# EAGLE design controllerv2 (EAGLE 6.1)
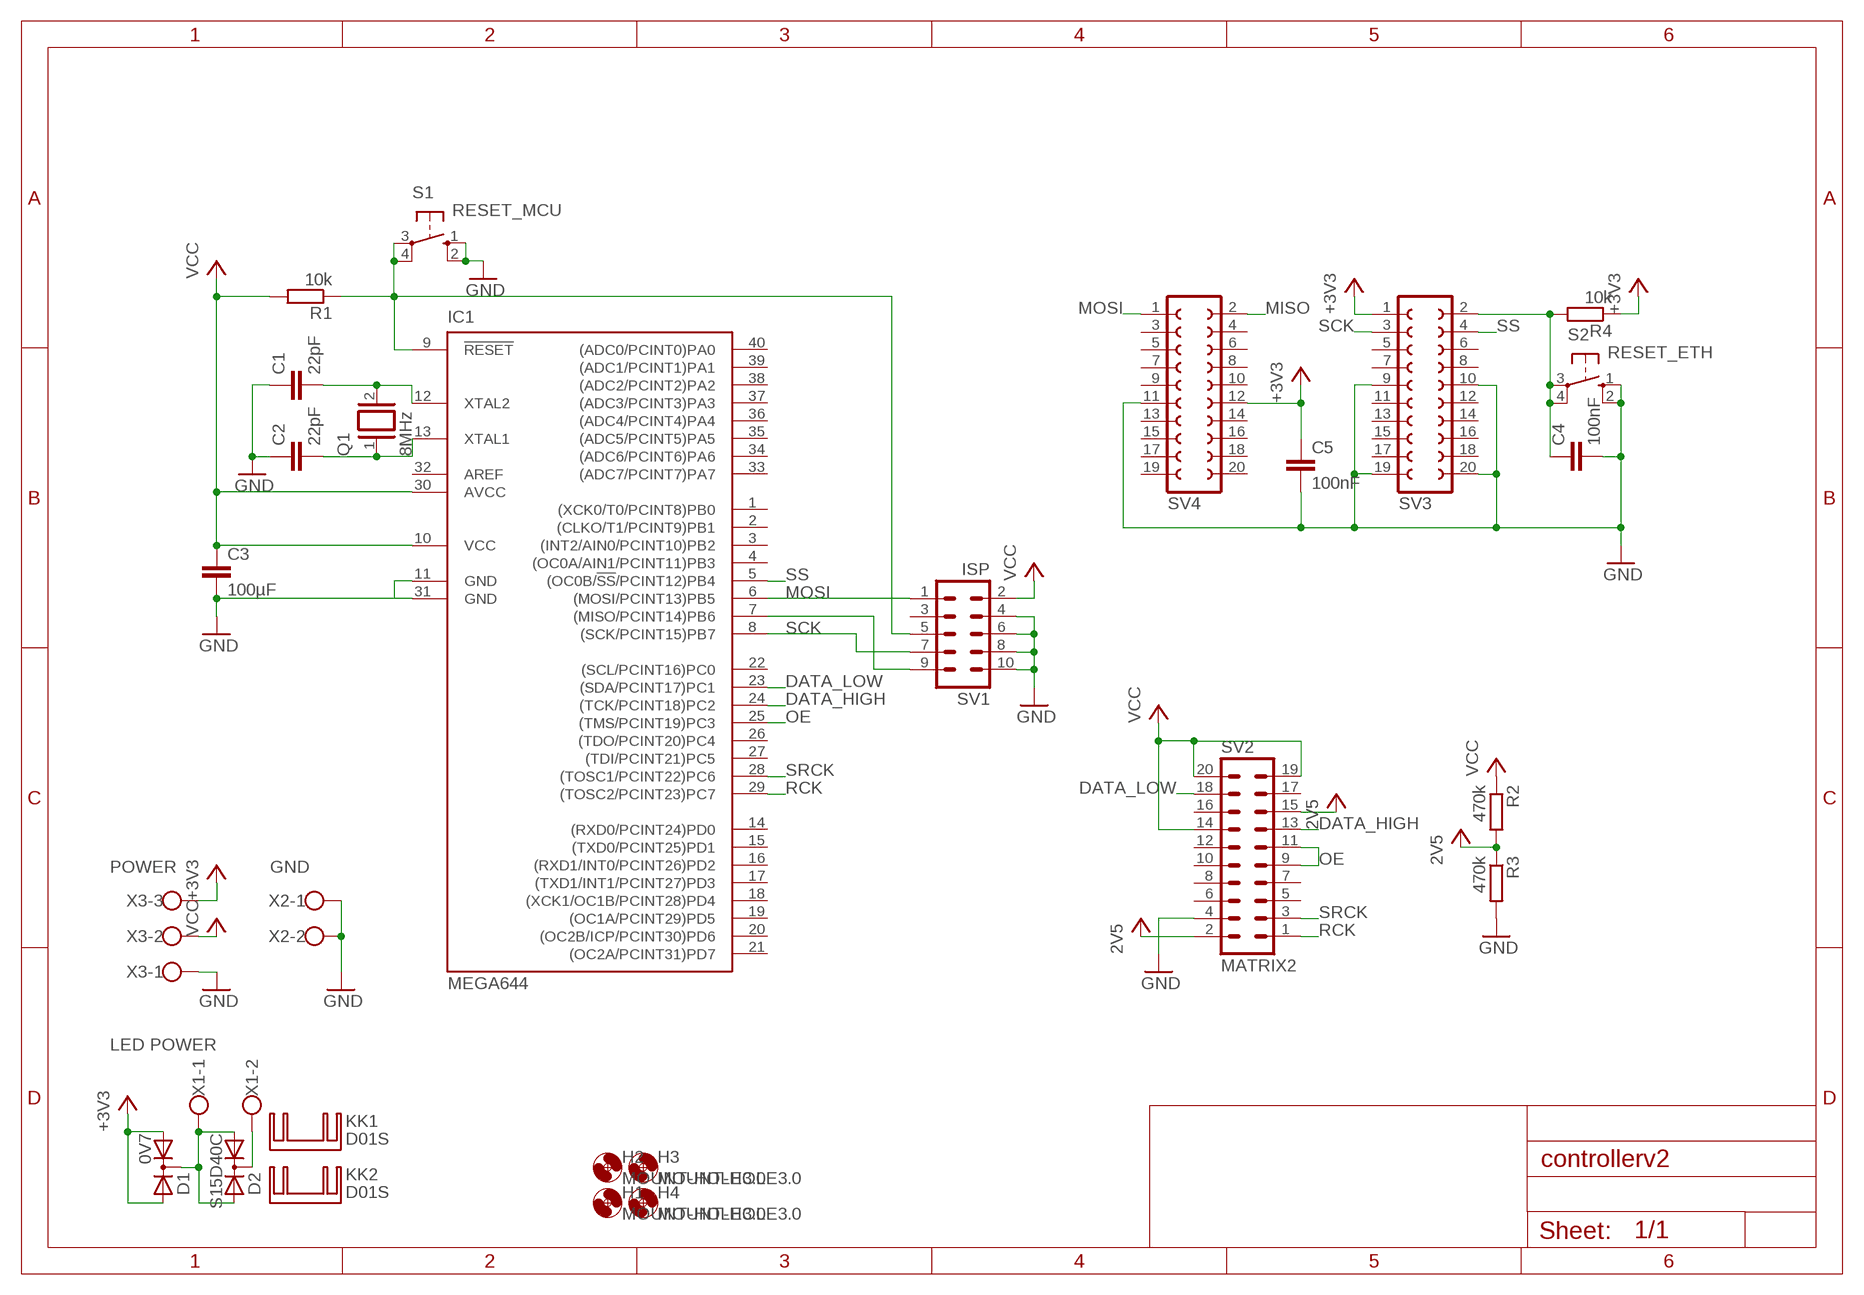
[diagram p0: schematic, sheet 1]

## Parts
C1  22pF  C-EU050-024X044  [C050-024X044]
C2  22pF  C-EU050-024X044  [C050-024X044]
C3  100µF  C-EU050-030X075  [C050-030X075]
C4  100nF  C-EU050-024X044  [C050-024X044]
C5  100nF  C-EU050-024X044  [C050-024X044]
D1  0V7  S15D40C  [TO247BV]
D2  S15D40C  [TO247BV]
H1  MOUNT-HOLE3.0  [3,0]
H2  MOUNT-HOLE3.0  [3,0]
H3  MOUNT-HOLE3.0  [3,0]
H4  MOUNT-HOLE3.0  [3,0]
IC1  MEGA644  MEGA164P/324P/644P-PU  [DIL40]
KK1  D01S  [D01S]
KK2  D01S  [D01S]
Q1  8MHz  XTAL/S  [QS]
R1  10k  R-EU_0207/10  [0207/10]
R2  470k  R-EU_0207/10  [0207/10]
R3  470k  R-EU_0207/10  [0207/10]
R4  10k  R-EU_0207/10  [0207/10]
S1  RESET_MCU  10-XX  [B3F-10XX]
S2  RESET_ETH  10-XX  [B3F-10XX]
SV1  ISP  ML10  [ML10]
SV2  MATRIX2  ML20  [ML20]
SV3  FE10-2  [FE10-2]
SV4  FE10-2  [FE10-2]
X1  LED POWER  W237-102  [W237-102]
X2  GND  W237-102  [W237-102]
X3  POWER  W237-103  [W237-103]

## Nets
+3V3: C5.1 D1.G(A1) D1.S(A2) R2.2 R3.1 R4.1 SV2.2 SV2.15 SV3.1 SV4.12 X3.3 ; supply symbol labelled 2V5
DATA_HIGH: IC1.24((TCK/PCINT18)PC2) SV2.13
DATA_LOW: IC1.23((SDA/PCINT17)PC1) SV2.18
GND: C1.1 C2.1 C3.2 C4.2 C5.2 IC1.11(GND) IC1.31(GND) R3.2 S1.1(S) S1.2(S1) S2.1(S) S2.2(S1) SV1.4 SV1.6 SV1.8 SV1.10 SV2.4 SV3.9 SV3.10 SV3.19 SV3.20 SV4.11 X2.1 X2.2 X3.1
MISO: SV4.2
MOSI: IC1.6((MOSI/PCINT13)PB5) SV1.1 SV4.1
N$1: C4.1 R4.2 S2.3(P) S2.4(P1) SV3.2
N$2: C2.2 IC1.13(XTAL1) Q1.1
N$3: C1.2 IC1.12(XTAL2) Q1.2
N$4: IC1.9(!RESET) R1.1 S1.3(P) S1.4(P1) SV1.5
N$6: IC1.7((MISO/PCINT14)PB6) SV1.9
N$7: D1.D(C) D2.G(A1) D2.S(A2) X1.1
N$8: D2.D(C) X1.2
OE: IC1.25((TMS/PCINT19)PC3) SV2.9 SV2.11
RCK: IC1.29((TOSC2/PCINT23)PC7) SV2.1
SCK: IC1.8((SCK/PCINT15)PB7) SV1.7 SV3.3
SRCK: IC1.28((TOSC1/PCINT22)PC6) SV2.3
SS: IC1.5((OC0B/!SS!/PCINT12)PB4) SV3.4
VCC: C3.1 IC1.10(VCC) IC1.30(AVCC) R1.2 R2.1 SV1.2 SV2.14 SV2.19 SV2.20 X3.2
Unconnected: IC1.1((XCK0/T0/PCINT8)PB0) IC1.2((CLKO/T1/PCINT9)PB1) IC1.3((INT2/AIN0/PCINT10)PB2) IC1.4((OC0A/AIN1/PCINT11)PB3) IC1.14((RXD0/PCINT24)PD0) IC1.15((TXD0/PCINT25)PD1) IC1.16((RXD1/INT0/PCINT26)PD2) IC1.17((TXD1/INT1/PCINT27)PD3) IC1.18((XCK1/OC1B/PCINT28)PD4) IC1.19((OC1A/PCINT29)PD5) IC1.20((OC2B/ICP/PCINT30)PD6) IC1.21((OC2A/PCINT31)PD7) IC1.22((SCL/PCINT16)PC0) IC1.26((TDO/PCINT20)PC4) IC1.27((TDI/PCINT21)PC5) IC1.33((ADC7/PCINT7)PA7) IC1.34((ADC6/PCINT6)PA6) IC1.35((ADC5/PCINT5)PA5) IC1.36((ADC4/PCINT4)PA4) IC1.37((ADC3/PCINT3)PA3) IC1.38((ADC2/PCINT2)PA2) IC1.39((ADC1/PCINT1)PA1) IC1.40((ADC0/PCINT0)PA0) SV1.3 SV2.5 SV2.6 SV2.7 SV2.8 SV2.10 SV2.12 SV2.16 SV2.17 SV3.5 SV3.6 SV3.7 SV3.8 SV3.11 SV3.12 SV3.13 SV3.14 SV3.15 SV3.16 SV3.17 SV3.18 SV4.3 SV4.4 SV4.5 SV4.6 SV4.7 SV4.8 SV4.9 SV4.10 SV4.13 SV4.14 SV4.15 SV4.16 SV4.17 SV4.18 SV4.19 SV4.20

## Power pins joined to a net without a drawn wire
AREF: IC1.32(AREF)

## Library data of the parts
C1-C5 = resistor:C-EU: CAPACITOR, European symbol
D1 D2 = parts:S15D40C
H1-H4 = holes:MOUNT-HOLE: MOUNTING HOLE with drill center marker
IC1 = avr-5:MEGA164P/324P/644P-PU
KK1 KK2 = heatsink:D01S: HEATSINK distributor Schukat
Q1 = special:XTAL/S: CRYSTAL
R1-R4 = resistor:R-EU_: RESISTOR, European symbol
S1 S2 = switch-omron:10-XX: OMRON SWITCH; MPN: B3F-1000; OC_FARNELL: 176432; OC_NEWARK: 36M3542
SV1 = con-ml:ML10: HARTING; OC_FARNELL: unknown; OC_NEWARK: unknown
SV2 = con-ml:ML20: HARTING; OC_FARNELL: unknown; OC_NEWARK: unknown
SV3 SV4 = con-lsta:FE10-2: FEMALE HEADER; OC_FARNELL: unknown; OC_NEWARK: unknown
X1 X2 = con-wago-500:W237-102: WAGO SCREW CLAMP; MPN: 237-102; OC_FARNELL: unknown; OC_NEWARK: 70K9898
X3 = con-wago-500:W237-103: WAGO SCREW CLAMP; MPN: 237-103; OC_FARNELL: unknown; OC_NEWARK: 18M7116

## Board
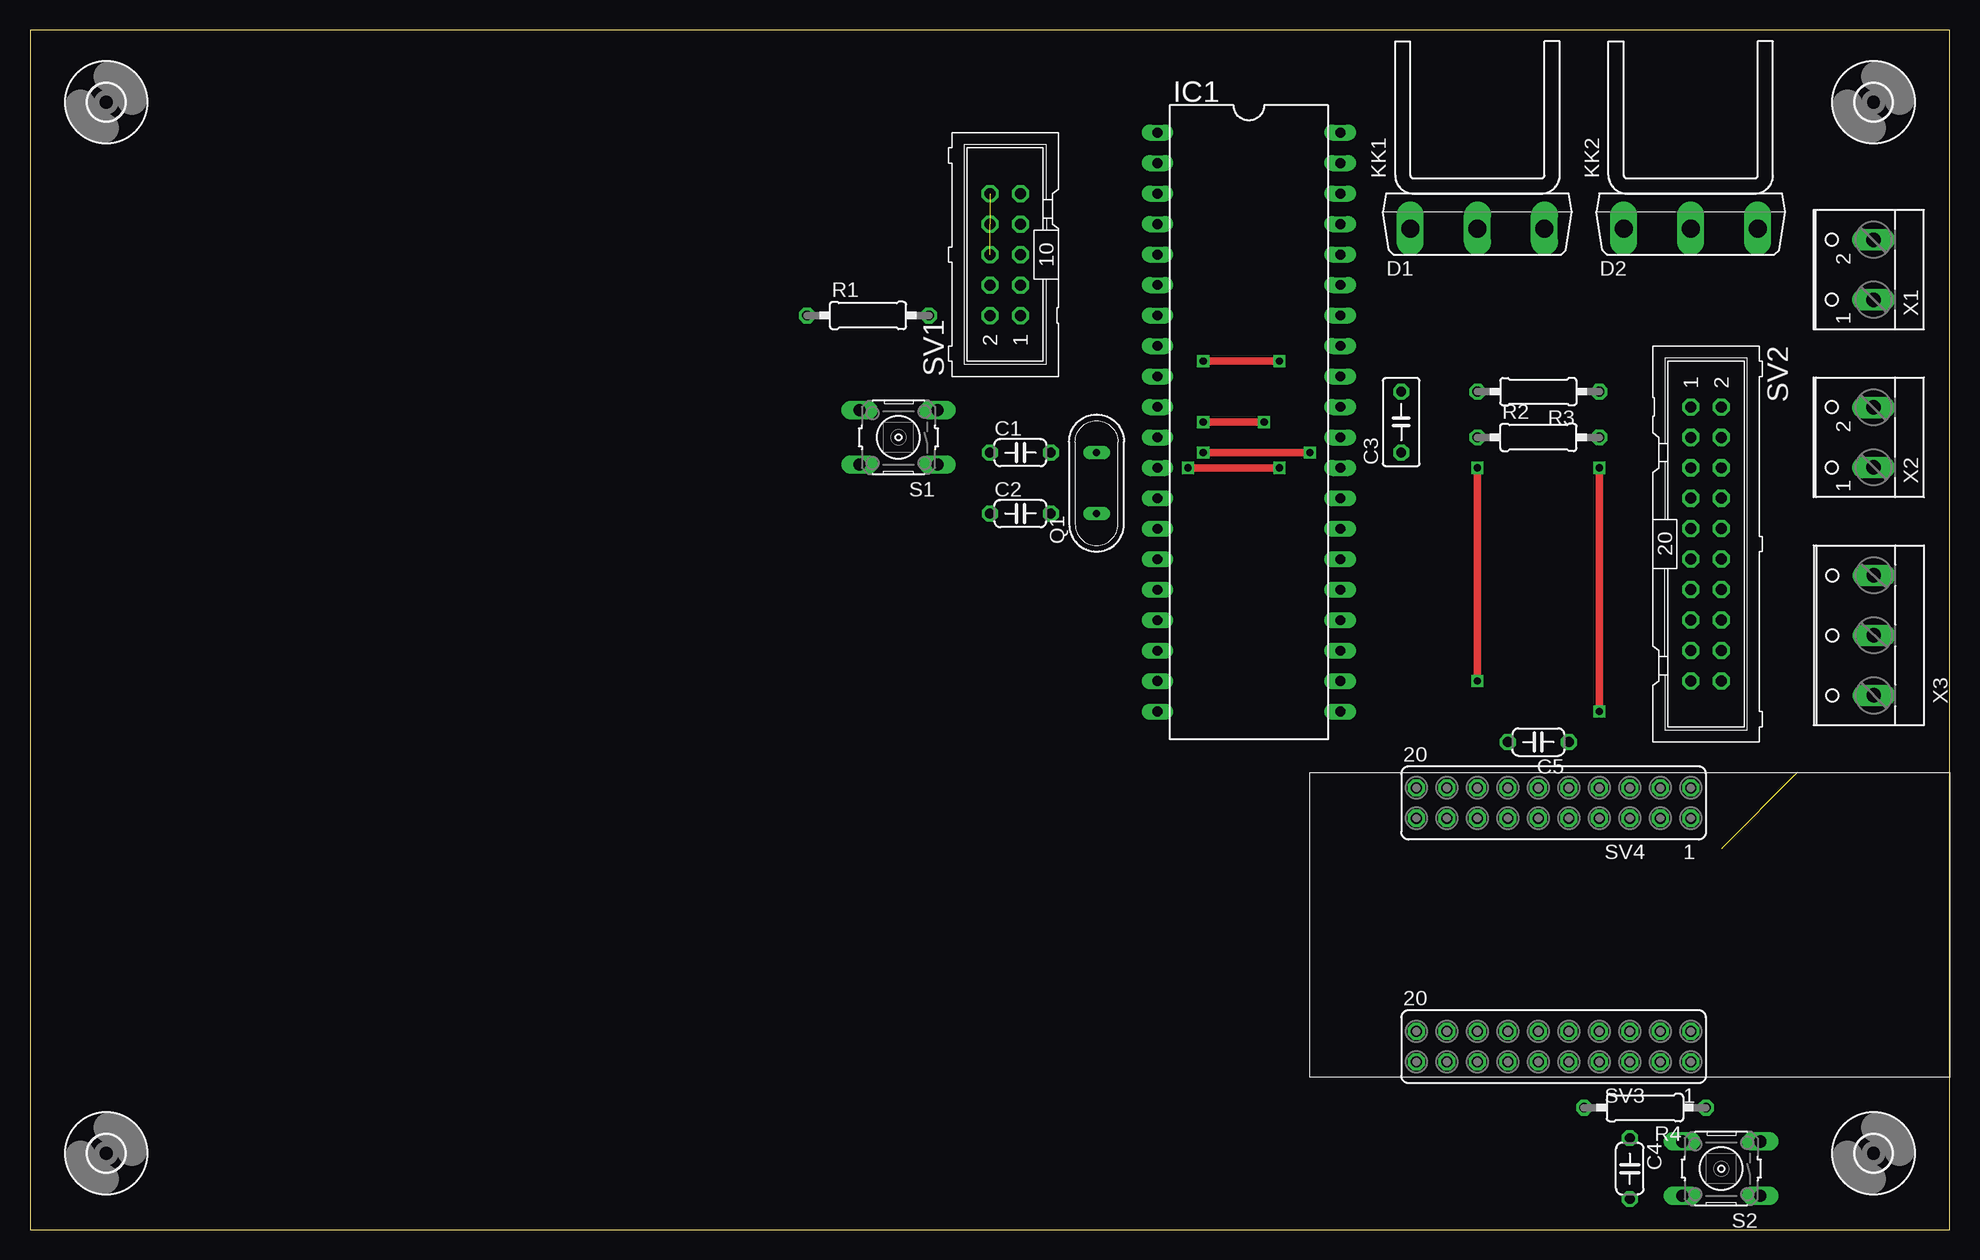
[diagram p1: board, top side]
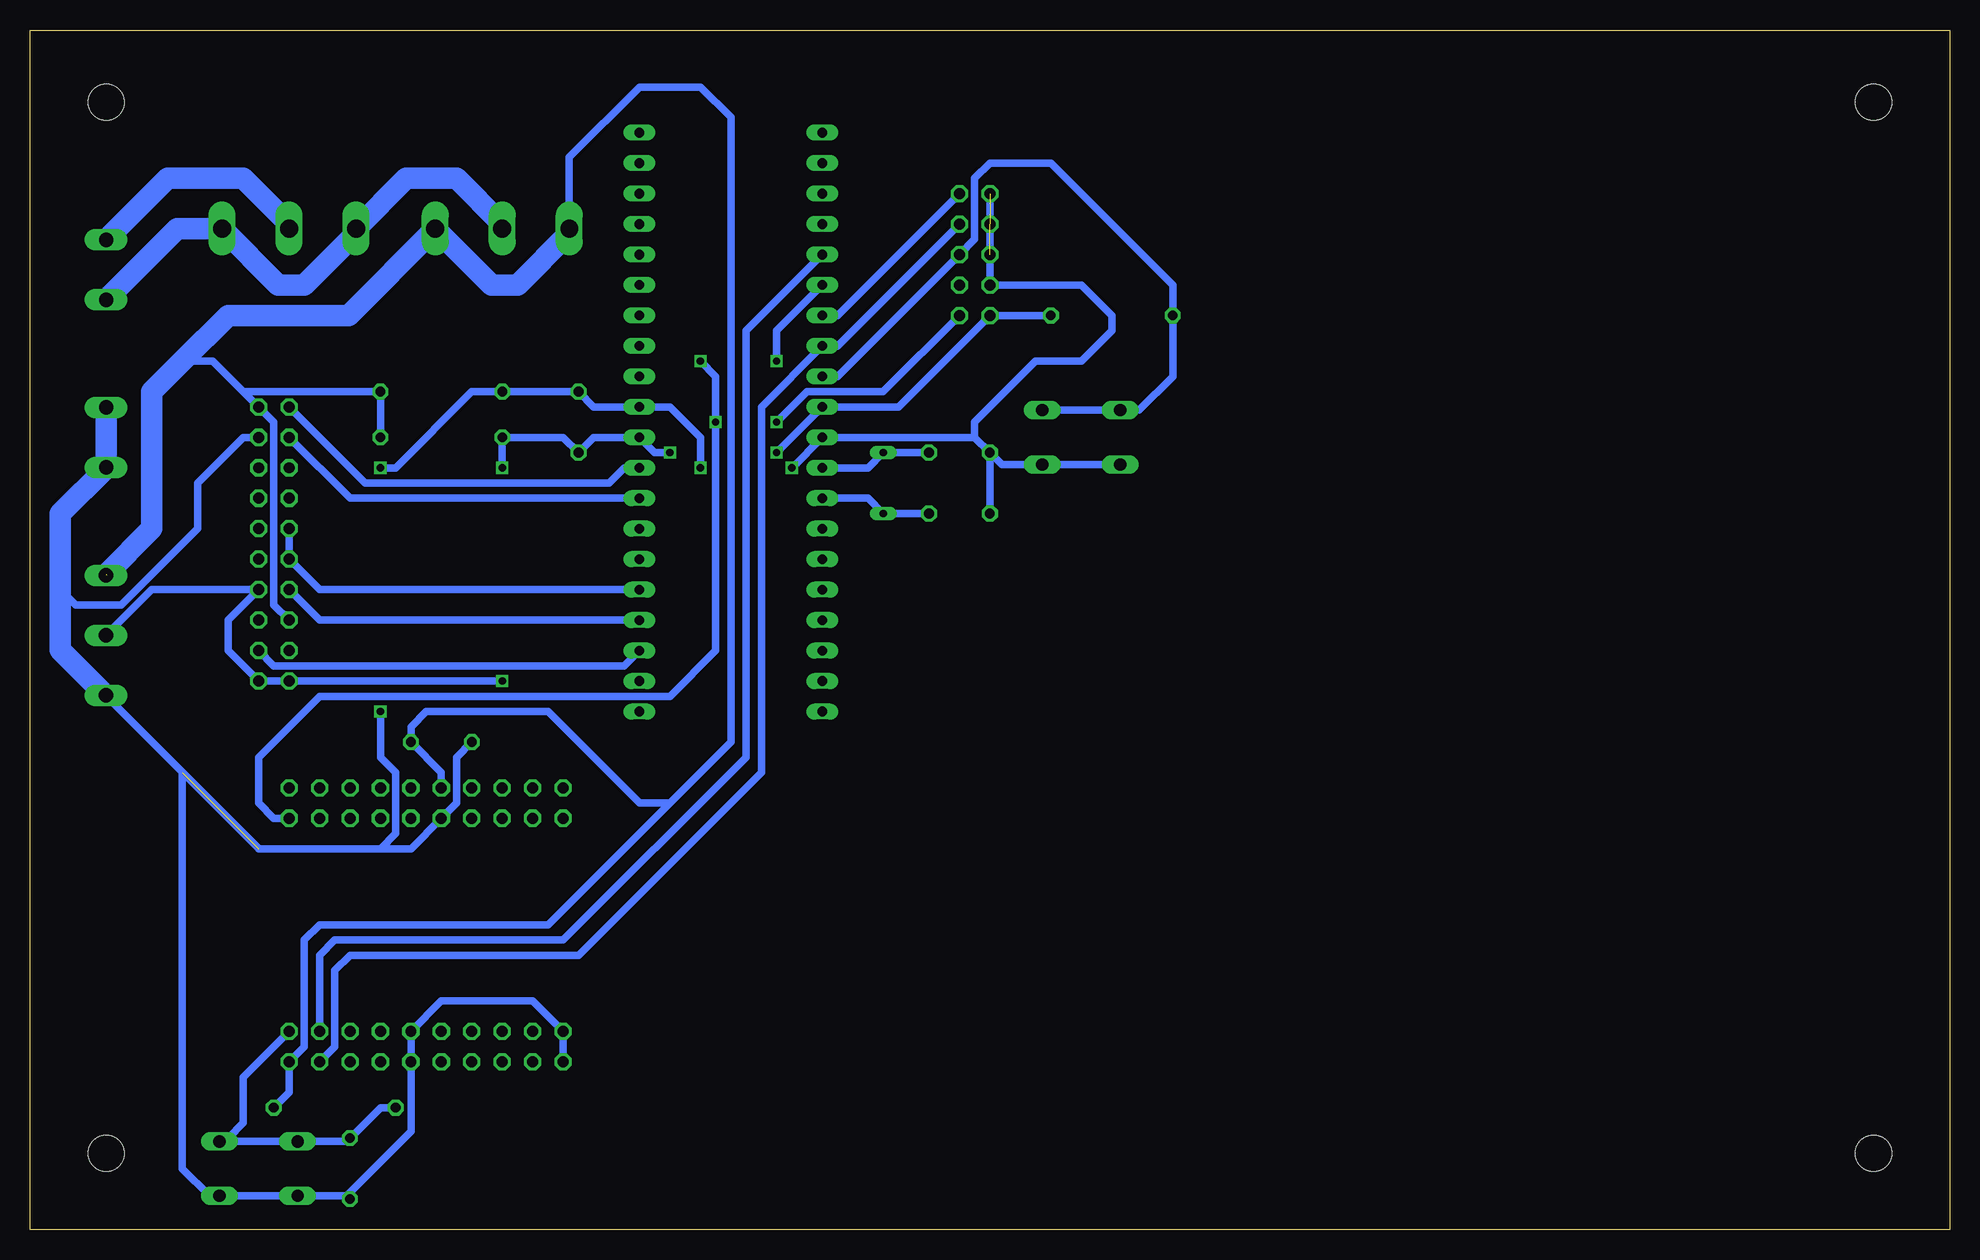
[diagram p2: board, bottom side, seen from below]

Size 160.02 x 100 mm. Coordinates in mm from the lower left corner, seen from the top.
Outline: 160,0 160,100 0,100 0,0 160.02,0
Copper layers (1*16): Top 0.035mm / dielectric 1.5mm / Bottom 0.035mm
Design rules: minimum track width 10mil, minimum drill 24mil, track to track 8mil, track to pad 8mil, pad to pad 8mil, via to via 8mil, smd to smd 8mil, copper to edge 40mil, drill to drill 8mil, minimum pad ring 10mil, minimum via ring 8mil, stop-mask expansion 4mil, vias tented up to drill 0mil, thermal gap 10mil

### Footprints (pad centres in the part's own frame; a part is rotated, then mirrored left to right if it is on the bottom)
C050-024X044 = drill 0.813 octagon: 1 -2.54,0; 2 2.54,0
C050-030X075 = drill 0.813 octagon: 1 -2.54,0; 2 2.54,0
TO247BV = drill 1.499 long: D 0,-2.921; G -5.588,-2.921; S 5.588,-2.921
3,0 = hole 3: 0,0
DIL40 = drill 0.813 long: 1 -24.13,-7.62; 2 -21.59,-7.62; 3 -19.05,-7.62; 4 -16.51,-7.62; 5 -13.97,-7.62; 6 -11.43,-7.62; 7 -8.89,-7.62; 8 -6.35,-7.62; 9 -3.81,-7.62; 10 -1.27,-7.62; 11 1.27,-7.62; 12 3.81,-7.62; 13 6.35,-7.62; 14 8.89,-7.62; 15 11.43,-7.62; 16 13.97,-7.62; 17 16.51,-7.62; 18 19.05,-7.62; 19 21.59,-7.62; 20 24.13,-7.62; 21 24.13,7.62; 22 21.59,7.62; 23 19.05,7.62; 24 16.51,7.62; 25 13.97,7.62; 26 11.43,7.62; 27 8.89,7.62; 28 6.35,7.62; 29 3.81,7.62; 30 1.27,7.62; 31 -1.27,7.62; 32 -3.81,7.62; 33 -6.35,7.62; 34 -8.89,7.62; 35 -11.43,7.62; 36 -13.97,7.62; 37 -16.51,7.62; 38 -19.05,7.62; 39 -21.59,7.62; 40 -24.13,7.62
QS = drill 0.61 long: 1 -2.54,0; 2 2.54,0
0207/10 = drill 0.813 octagon: 1 -5.08,0; 2 5.08,0
B3F-10XX = drill 1.016 long: 1 -3.251,2.261; 2 3.251,2.261; 3 -3.251,-2.261; 4 3.251,-2.261
ML10 = drill 0.914 octagon: 1 -5.08,-1.27; 2 -5.08,1.27; 3 -2.54,-1.27; 4 -2.54,1.27; 5 0,-1.27; 6 0,1.27; 7 2.54,-1.27; 8 2.54,1.27; 9 5.08,-1.27; 10 5.08,1.27
ML20 = drill 0.914 octagon: 1 -11.43,-1.27; 2 -11.43,1.27; 3 -8.89,-1.27; 4 -8.89,1.27; 5 -6.35,-1.27; 6 -6.35,1.27; 7 -3.81,-1.27; 8 -3.81,1.27; 9 -1.27,-1.27; 10 -1.27,1.27; 11 1.27,-1.27; 12 1.27,1.27; 13 3.81,-1.27; 14 3.81,1.27; 15 6.35,-1.27; 16 6.35,1.27; 17 8.89,-1.27; 18 8.89,1.27; 19 11.43,-1.27; 20 11.43,1.27
FE10-2 = drill 0.914 octagon: 1 -11.43,1.27; 2 -11.43,-1.27; 3 -8.89,1.27; 4 -8.89,-1.27; 5 -6.35,1.27; 6 -6.35,-1.27; 7 -3.81,1.27; 8 -3.81,-1.27; 9 -1.27,1.27; 10 -1.27,-1.27; 11 1.27,1.27; 12 1.27,-1.27; 13 3.81,1.27; 14 3.81,-1.27; 15 6.35,1.27; 16 6.35,-1.27; 17 8.89,1.27; 18 8.89,-1.27; 19 11.43,1.27; 20 11.43,-1.27
W237-102 = drill 1.194 long: 1 -2.5,-1.27; 2 2.5,-1.27
W237-103 = drill 1.194 long: 1 -5,-1.29; 2 0,-1.29; 3 5,-1.29

### Placement (x,y rotation side)
C1  82.55,64.77 0 top
C2  82.55,59.69 0 top
C3  114.3,67.31 90 top
C4  133.35,5.08 270 top
C5  125.73,40.64 180 top
D1  120.65,86.36 0 top
D2  138.43,86.36 0 top
H1  153.67,93.98 0 top
H2  153.67,6.35 0 top
H3  6.35,6.35 0 top
H4  6.35,93.98 0 top
IC1  101.6,67.31 270 top
KK1  120.65,87.63 0 top
KK2  138.43,87.63 0 top
Q1  88.9,62.23 90 top
R1  69.85,76.2 0 top
R2  125.73,66.04 0 top
R3  125.73,69.85 180 top
R4  134.62,10.16 180 top
S1  72.39,66.04 180 top
S2  140.97,5.08 180 top
SV1  81.28,81.28 90 top
SV2  139.7,57.15 270 top
SV3  127,15.24 180 top
SV4  127,35.56 180 top
X1  152.4,80.01 90 top
X2  152.4,66.04 90 top
X3  152.4,49.53 90 top

### Tracks (layer width: path | path; a pad name or v marks a point on that pad's centre or on a via)
+3V3  (1 unrouted)
  Bottom 0.61: X3.3 153.61,54.61 | SV2.15 139.7,52.07 139.7,67.31 SV2.2 142.24,69.85 | 147.32,72.39 144.78,72.39 142.88,70.48 142.24,69.85 | R4.1 138.43,11.43 SV3.1 137.16,15.24 137.16,24.13 135.89,25.4 116.84,25.4 106.68,35.56 | SV4.12 125.73,38.1 C5.1 128.27,41.91 127,43.18 116.84,43.18 109.22,35.56 106.68,35.56 | 106.68,35.56 101.6,40.64 101.6,92.71 104.14,95.25 109.22,95.25 115.06,89.41 D1.G | R2.2 R3.1 142.24,69.85
  Bottom 1.778: 153.67,54.61 149.86,58.42 149.86,69.85 147.32,72.39 143.51,76.2 133.48,76.2 D1.S 121.54,78.74 119.38,78.74 115.06,83.06 D1.G
DATA_HIGH
  Bottom 0.61: SV2.13 135.89,50.8 IC1.24
DATA_LOW
  Bottom 0.61: IC1.23 110.49,46.99 139.7,46.99 SV2.18
GND  (via drill 0.6)  (3 unrouted)
  Top 0.61: v96.52,63.5 v104.14,63.5 | v130.81,63.5 v130.81,43.18
  Bottom 0.61: C4.2 133.63,2.82 | 133.63,2.82 S2.2 S2.1 145.06,2.82 147.32,5.08 147.32,38.1 | 133.63,2.82 128.27,8.18 SV3.9 SV3.10 125.73,19.05 118.11,19.05 SV3.20 SV3.19 | C5.2 124.46,39.37 124.46,35.56 SV4.11 128.27,31.75 130.81,31.75 | 157.48,48.32 140.91,31.75 | 140.91,31.75 130.81,31.75 | 140.91,31.75 140.97,31.75 | C2.1 C1.1 | C1.1 79.02,63.78 S1.1 S1.2 | C1.1 81.28,66.04 | 81.28,66.04 IC1.11 v96.52,63.5 | SV1.10 SV1.4 72.39,78.74 69.85,76.2 69.85,74.93 72.39,72.39 76.2,72.39 81.28,67.31 81.28,66.04 | v104.14,63.5 104.14,66.04 106.68,68.58 IC1.31 113.03,68.58 C3.2 R3.2 123.19,69.85 129.54,63.5 v130.81,63.5 | v130.81,43.18 130.81,39.37 129.54,38.1 129.54,33.02 130.81,31.75 | SV2.4 142.24,66.04 146.05,62.23 146.05,58.42 152.4,52.07 156.21,52.07 157.48,53.34
  Bottom 1.778: X3.1 157.48,48.32 157.48,53.34 157.48,59.69 153.67,63.5 X2.1 X2.2
MOSI  (via drill 0.6)
  Top 0.61: v104.14,72.39 v97.79,72.39 | v97.79,67.31 v102.87,67.31
  Bottom 0.61: SV4.1 139.7,34.29 140.97,35.56 140.97,39.37 135.89,44.45 106.68,44.45 102.87,48.26 v102.87,67.31 102.87,71.12 v104.14,72.39 | v97.79,72.39 97.79,74.93 IC1.6 | SV1.1 88.9,69.85 95.25,69.85 v97.79,67.31
N$1
  Bottom 0.61: S2.3 143.51,7.34 | 143.51,7.34 S2.4 133.63,7.34 C4.1 130.81,10.16 R4.2 | SV3.2 142.24,12.7 142.24,8.89 143.51,7.62 143.51,7.34
N$2
  Bottom 0.61: IC1.13 90.17,60.96 Q1.1 C2.2
N$3
  Bottom 0.61: IC1.12 90.17,63.5 Q1.2 C1.2
N$4
  Bottom 0.61: S1.3 S1.4 67.59,68.3 64.77,71.12 R1.1 64.77,78.74 74.93,88.9 80.01,88.9 81.28,87.63 81.28,82.55 SV1.5 92.71,71.12 IC1.9
N$6
  Bottom 0.61: SV1.9 92.71,76.2 IC1.7
N$7
  Bottom 1.778: D1.D 120.65,83.82 124.46,87.63 128.65,87.63 D2.G 132.84,83.06 137.16,78.74 139.32,78.74 D2.S 147.74,83.44 X1.1
N$8
  Bottom 1.778: X1.2 148.55,87.63 142.24,87.63 138.43,83.82 D2.D
OE
  Bottom 0.61: SV2.9 SV2.11 135.89,53.34 IC1.25
RCK
  Bottom 0.61: IC1.29 110.49,63.5 111.76,62.23 132.08,62.23 SV2.1
SCK
  Bottom 0.61: SV3.3 134.62,15.24 134.62,21.59 133.35,22.86 114.3,22.86 99.06,38.1 99.06,68.58 IC1.8 92.71,73.66 SV1.7
SRCK
  Bottom 0.61: IC1.28 133.35,60.96 SV2.3
SS
  Bottom 0.61: SV3.4 135.89,22.86 134.62,24.13 115.57,24.13 100.33,39.37 100.33,74.93 IC1.5
VCC  (via drill 0.6)
  Top 0.61: v97.79,64.77 v106.68,64.77 | v120.65,63.5 v120.65,45.72
  Bottom 0.61: X3.2 149.88,53.34 SV2.14 143.51,50.8 143.51,48.26 SV2.20 SV2.19 v120.65,45.72 | R1.2 SV1.2 87.63,68.58 IC1.10 v97.79,64.77 | v106.68,64.77 107.95,64.77 IC1.30 113.03,66.04 C3.1 115.57,66.04 R2.1 v120.65,63.5